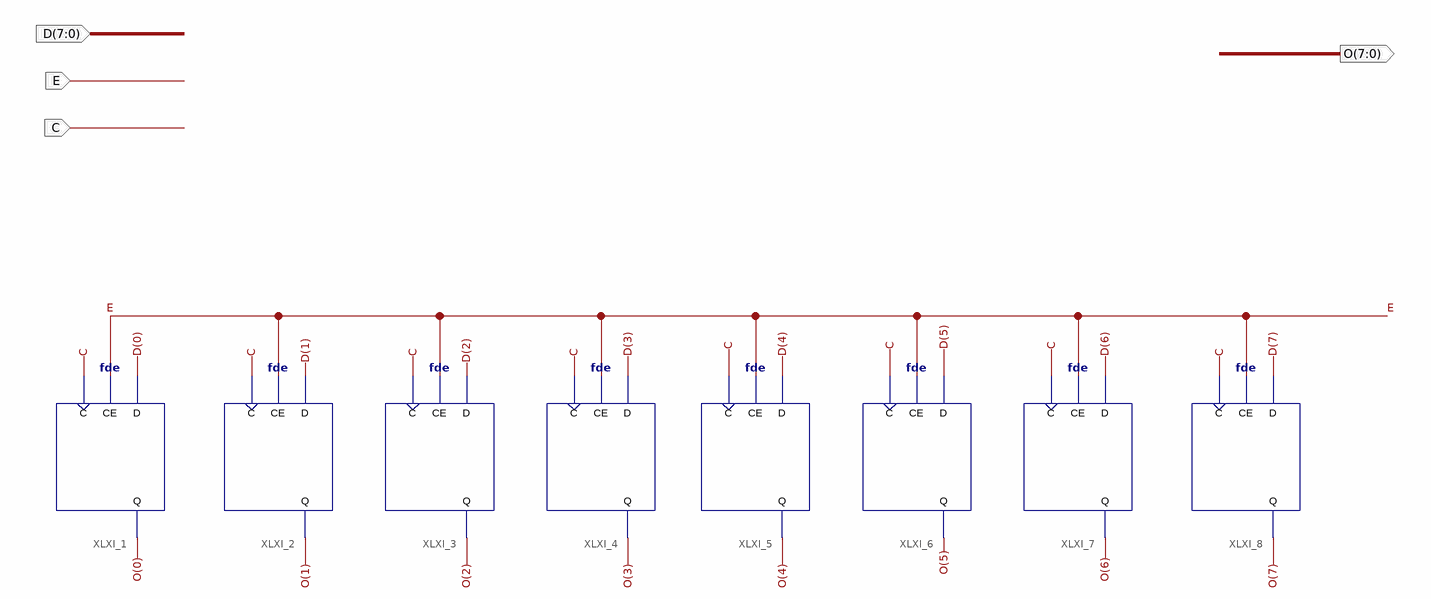
[diagram p0: schematic sheet 1]
// Xilinx ISE schematic bit_8_register.sch (spartan6) as structural Verilog: 8 symbols, 4 ports
module bit_8_register (
  input  C,
  input  [7:0] D,
  input  E,
  output [7:0] O
);

  fde XLXI_1 (.C(C), .CE(E), .D(D[0]), .Q(O[0]));
  fde XLXI_4 (.C(C), .CE(E), .D(D[3]), .Q(O[3]));
  fde XLXI_5 (.C(C), .CE(E), .D(D[4]), .Q(O[4]));
  fde XLXI_6 (.C(C), .CE(E), .D(D[5]), .Q(O[5]));
  fde XLXI_7 (.C(C), .CE(E), .D(D[6]), .Q(O[6]));
  fde XLXI_8 (.C(C), .CE(E), .D(D[7]), .Q(O[7]));
  fde XLXI_2 (.C(C), .CE(E), .D(D[1]), .Q(O[1]));
  fde XLXI_3 (.C(C), .CE(E), .D(D[2]), .Q(O[2]));
endmodule
